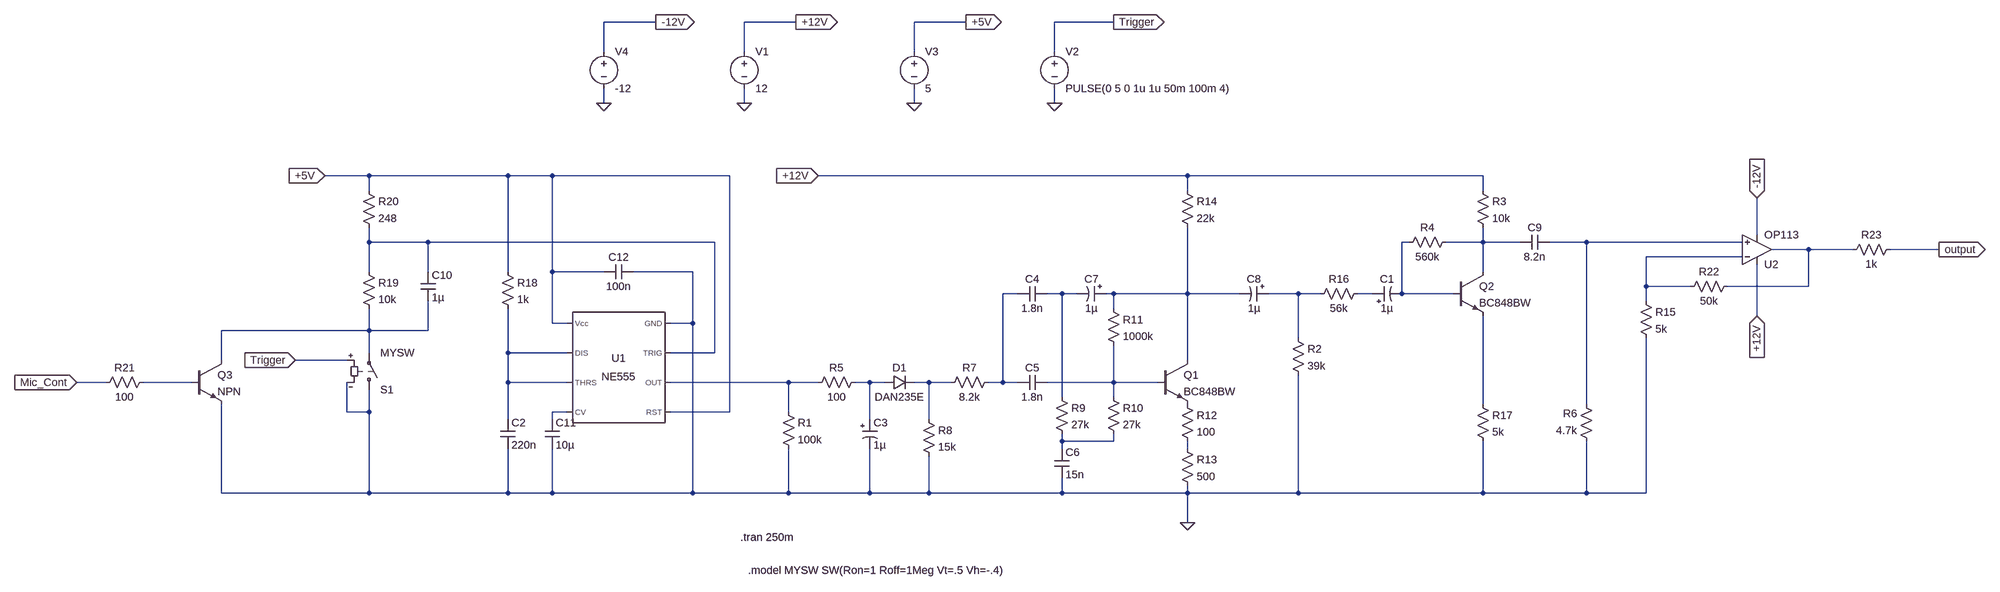
[diagram p0: schematic Platine_1.asc]
Platine_1.asc, the LTspice schematic file:
Version 4
SHEET 1 3512 680
WIRE 448 -880 336 -880
WIRE 752 -880 640 -880
WIRE 1120 -880 1008 -880
WIRE 1440 -880 1312 -880
WIRE 336 -816 336 -880
WIRE 640 -816 640 -880
WIRE 1008 -816 1008 -880
WIRE 1312 -816 1312 -880
WIRE 336 -704 336 -736
WIRE 640 -704 640 -736
WIRE 1008 -704 1008 -736
WIRE 1312 -704 1312 -736
WIRE -176 -480 -272 -480
WIRE 128 -480 -176 -480
WIRE 224 -480 128 -480
WIRE 608 -480 224 -480
WIRE 1600 -480 800 -480
WIRE 2240 -480 1600 -480
WIRE -176 -448 -176 -480
WIRE 1600 -448 1600 -480
WIRE 2240 -448 2240 -480
WIRE 2880 -352 2880 -432
WIRE -176 -336 -176 -368
WIRE -48 -336 -176 -336
WIRE 576 -336 -48 -336
WIRE 2080 -336 2064 -336
WIRE 2240 -336 2240 -368
WIRE 2240 -336 2160 -336
WIRE 2320 -336 2240 -336
WIRE 2464 -336 2384 -336
WIRE 2848 -336 2464 -336
WIRE 2992 -320 2912 -320
WIRE 3088 -320 2992 -320
WIRE 3376 -320 3168 -320
WIRE 2848 -304 2640 -304
WIRE -176 -272 -176 -336
WIRE -48 -272 -48 -336
WIRE 128 -272 128 -480
WIRE 224 -272 224 -480
WIRE 336 -272 224 -272
WIRE 528 -272 400 -272
WIRE 2240 -272 2240 -336
WIRE 2640 -240 2640 -304
WIRE 2736 -240 2640 -240
WIRE 2992 -240 2992 -320
WIRE 2992 -240 2816 -240
WIRE 1232 -224 1200 -224
WIRE 1328 -224 1296 -224
WIRE 1360 -224 1328 -224
WIRE 1440 -224 1424 -224
WIRE 1600 -224 1600 -368
WIRE 1600 -224 1440 -224
WIRE 1712 -224 1600 -224
WIRE 1840 -224 1776 -224
WIRE 1888 -224 1840 -224
WIRE 2000 -224 1968 -224
WIRE 2064 -224 2064 -336
WIRE 2176 -224 2064 -224
WIRE 2640 -208 2640 -240
WIRE 1440 -192 1440 -224
WIRE 2880 -176 2880 -288
WIRE 224 -160 224 -272
WIRE 256 -160 224 -160
WIRE 528 -160 528 -272
WIRE 528 -160 480 -160
WIRE -176 -144 -176 -192
WIRE -176 -144 -496 -144
WIRE -48 -144 -48 -208
WIRE -48 -144 -176 -144
WIRE 1840 -128 1840 -224
WIRE -176 -96 -176 -144
WIRE 128 -96 128 -192
WIRE 256 -96 128 -96
WIRE 576 -96 576 -336
WIRE 576 -96 480 -96
WIRE -496 -80 -496 -144
WIRE -224 -80 -336 -80
WIRE 1600 -80 1600 -224
WIRE -752 -32 -816 -32
WIRE -560 -32 -672 -32
WIRE 128 -32 128 -96
WIRE 256 -32 128 -32
WIRE 736 -32 480 -32
WIRE 800 -32 736 -32
WIRE 912 -32 880 -32
WIRE 944 -32 912 -32
WIRE 1040 -32 1008 -32
WIRE 1088 -32 1040 -32
WIRE 1200 -32 1200 -224
WIRE 1200 -32 1168 -32
WIRE 1232 -32 1200 -32
WIRE 1440 -32 1440 -112
WIRE 1440 -32 1296 -32
WIRE 1536 -32 1440 -32
WIRE 1328 0 1328 -224
WIRE 1440 0 1440 -32
WIRE 2240 16 2240 -176
WIRE 2464 16 2464 -336
WIRE -224 32 -224 -32
WIRE -176 32 -176 -16
WIRE -176 32 -224 32
WIRE 256 32 224 32
WIRE 608 32 608 -480
WIRE 608 32 480 32
WIRE 736 32 736 -32
WIRE 128 48 128 -32
WIRE 224 48 224 32
WIRE 912 48 912 -32
WIRE 1040 48 1040 -32
WIRE 1328 96 1328 80
WIRE 1440 96 1440 80
WIRE 1440 96 1328 96
WIRE 1328 112 1328 96
WIRE 1600 112 1600 96
WIRE -496 208 -496 16
WIRE -176 208 -176 32
WIRE -176 208 -496 208
WIRE 128 208 128 112
WIRE 128 208 -176 208
WIRE 224 208 224 112
WIRE 224 208 128 208
WIRE 528 208 528 -160
WIRE 528 208 224 208
WIRE 736 208 736 112
WIRE 736 208 528 208
WIRE 912 208 912 112
WIRE 912 208 736 208
WIRE 1040 208 1040 128
WIRE 1040 208 912 208
WIRE 1328 208 1328 176
WIRE 1328 208 1040 208
WIRE 1600 208 1600 192
WIRE 1600 208 1328 208
WIRE 1840 208 1840 -48
WIRE 1840 208 1600 208
WIRE 2240 208 2240 96
WIRE 2240 208 1840 208
WIRE 2464 208 2464 96
WIRE 2464 208 2240 208
WIRE 2640 208 2640 -128
WIRE 2640 208 2464 208
WIRE 1600 272 1600 208
FLAG 752 -880 +12V
IOPIN 752 -880 Out
FLAG 640 -704 0
FLAG 1440 -880 Trigger
IOPIN 1440 -880 Out
FLAG 1312 -704 0
FLAG 1600 272 0
FLAG 800 -480 +12V
IOPIN 800 -480 In
FLAG -336 -80 Trigger
IOPIN -336 -80 In
FLAG 1120 -880 +5V
IOPIN 1120 -880 Out
FLAG 1008 -704 0
FLAG -272 -480 +5V
IOPIN -272 -480 In
FLAG -816 -32 Mic_Cont
IOPIN -816 -32 In
FLAG 3376 -320 output
IOPIN 3376 -320 Out
FLAG 448 -880 -12V
IOPIN 448 -880 Out
FLAG 336 -704 0
FLAG 2880 -432 -12V
IOPIN 2880 -432 In
FLAG 2880 -176 +12V
IOPIN 2880 -176 In
SYMBOL res 1184 -48 R90
WINDOW 0 0 56 VBottom 2
WINDOW 3 32 56 VTop 2
SYMATTR InstName R7
SYMATTR Value 8.2k
SYMBOL cap 1296 -48 R90
WINDOW 0 0 32 VBottom 2
WINDOW 3 32 32 VTop 2
SYMATTR InstName C5
SYMATTR Value 1.8n
SYMBOL res 1024 32 R0
SYMATTR InstName R8
SYMATTR Value 15k
SYMBOL res 1312 -16 R0
SYMATTR InstName R9
SYMATTR Value 27k
SYMBOL cap 1312 112 R0
SYMATTR InstName C6
SYMATTR Value 15n
SYMBOL res 1424 -16 R0
SYMATTR InstName R10
SYMATTR Value 27k
SYMBOL res 1424 -208 R0
SYMATTR InstName R11
SYMATTR Value 1000k
SYMBOL res 1584 0 R0
SYMATTR InstName R12
SYMATTR Value 100
SYMBOL res 1584 96 R0
SYMATTR InstName R13
SYMATTR Value 500
SYMBOL voltage 640 -832 R0
WINDOW 123 0 0 Left 0
WINDOW 39 0 0 Left 0
SYMATTR InstName V1
SYMATTR Value 12
SYMBOL res 896 -48 R90
WINDOW 0 0 56 VBottom 2
WINDOW 3 32 56 VTop 2
SYMATTR InstName R5
SYMATTR Value 100
SYMBOL polcap 896 48 R0
SYMATTR InstName C3
SYMATTR Value 1µ
SYMATTR SpiceLine V=10
SYMBOL diode 944 -16 R270
WINDOW 0 32 32 VTop 2
WINDOW 3 0 32 VBottom 2
SYMATTR InstName D1
SYMATTR Value DAN235E
SYMBOL cap 1296 -240 R90
WINDOW 0 0 32 VBottom 2
WINDOW 3 32 32 VTop 2
SYMATTR InstName C4
SYMATTR Value 1.8n
SYMBOL polcap 1424 -240 R90
WINDOW 0 0 32 VBottom 2
WINDOW 3 32 32 VTop 2
SYMATTR InstName C7
SYMATTR Value 1µ
SYMATTR SpiceLine V=25
SYMBOL polcap 1776 -240 R90
WINDOW 0 0 32 VBottom 2
WINDOW 3 32 32 VTop 2
SYMATTR InstName C8
SYMATTR Value 1µ
SYMATTR SpiceLine V=25
SYMBOL npn 1536 -80 R0
SYMATTR InstName Q1
SYMATTR Value BC848BW
SYMBOL res 1584 -464 R0
SYMATTR InstName R14
SYMATTR Value 22k
SYMBOL voltage 1312 -832 R0
WINDOW 123 0 0 Left 0
WINDOW 39 0 0 Left 0
SYMATTR InstName V2
SYMATTR Value PULSE(0 5 0 1u 1u 50m 100m 4)
SYMBOL res 720 16 R0
SYMATTR InstName R1
SYMATTR Value 100k
SYMBOL res 1824 -144 R0
SYMATTR InstName R2
SYMATTR Value 39k
SYMBOL polcap 2000 -208 R270
WINDOW 0 32 32 VTop 2
WINDOW 3 0 32 VBottom 2
SYMATTR InstName C1
SYMATTR Value 1µ
SYMATTR SpiceLine V=25
SYMBOL npn 2176 -272 R0
SYMATTR InstName Q2
SYMATTR Value BC848BW
SYMBOL res 2224 -464 R0
SYMATTR InstName R3
SYMATTR Value 10k
SYMBOL res 2176 -352 R90
WINDOW 0 0 56 VBottom 2
WINDOW 3 32 56 VTop 2
SYMATTR InstName R4
SYMATTR Value 560k
SYMBOL res 2480 112 R180
WINDOW 0 36 76 Left 2
WINDOW 3 36 40 Left 2
SYMATTR InstName R6
SYMATTR Value 4.7k
SYMBOL res 1984 -240 R90
WINDOW 0 0 56 VBottom 2
WINDOW 3 32 56 VTop 2
SYMATTR InstName R16
SYMATTR Value 56k
SYMBOL res 2224 0 R0
SYMATTR InstName R17
SYMATTR Value 5k
SYMBOL cap 2384 -352 R90
WINDOW 0 0 32 VBottom 2
WINDOW 3 32 32 VTop 2
SYMATTR InstName C9
SYMATTR Value 8.2n
SYMBOL Misc\\NE555 368 -64 M0
SYMATTR InstName U1
SYMBOL voltage 1008 -832 R0
WINDOW 123 0 0 Left 0
WINDOW 39 0 0 Left 0
SYMATTR InstName V3
SYMATTR Value 5
SYMBOL res 112 -288 R0
SYMATTR InstName R18
SYMATTR Value 1k
SYMBOL cap 112 48 R0
SYMATTR InstName C2
SYMATTR Value 220n
SYMBOL cap -64 -272 R0
SYMATTR InstName C10
SYMATTR Value 1µ
SYMBOL res -192 -288 R0
SYMATTR InstName R19
SYMATTR Value 10k
SYMBOL res -192 -464 R0
SYMATTR InstName R20
SYMATTR Value 248
SYMBOL npn -560 -80 R0
SYMATTR InstName Q3
SYMBOL sw -176 0 M180
SYMATTR InstName S1
SYMATTR Value MYSW
SYMBOL res -656 -48 R90
WINDOW 0 0 56 VBottom 2
WINDOW 3 32 56 VTop 2
SYMATTR InstName R21
SYMATTR Value 100
SYMBOL cap 208 48 R0
SYMATTR InstName C11
SYMATTR Value 10µ
SYMBOL cap 400 -288 R90
WINDOW 0 0 32 VBottom 2
WINDOW 3 32 32 VTop 2
SYMATTR InstName C12
SYMATTR Value 100n
SYMBOL OpAmps\\OP113 2880 -256 M180
SYMATTR InstName U2
SYMBOL voltage 336 -832 R0
WINDOW 123 0 0 Left 0
WINDOW 39 0 0 Left 0
SYMATTR InstName V4
SYMATTR Value -12
SYMBOL res 2624 -224 R0
SYMATTR InstName R15
SYMATTR Value 5k
SYMBOL res 2832 -256 R90
WINDOW 0 0 56 VBottom 2
WINDOW 3 32 56 VTop 2
SYMATTR InstName R22
SYMATTR Value 50k
SYMBOL res 3184 -336 R90
WINDOW 0 0 56 VBottom 2
WINDOW 3 32 56 VTop 2
SYMATTR InstName R23
SYMATTR Value 1k
TEXT 632 304 Left 2 !.tran 250m
TEXT 648 376 Left 2 !.model MYSW SW(Ron=1 Roff=1Meg Vt=.5 Vh=-.4)

The netlist it stands for:
* Platine_1.asc
R7 N007 N017 8.2k
C5 N018 N007 1.8n
R8 N017 0 15k
R9 N008 N021 27k
C6 N021 0 15n
R10 N018 N021 27k
R11 N009 N018 1000k
R12 P001 N022 100
R13 N022 0 500
V1 +12V 0 12
R5 N016 N015 100
C3 N016 0 1µ V=10
D1 N016 N017 DAN235E
C4 N008 N007 1.8n
C7 N009 N008 1µ V=25
C8 N010 N009 1µ V=25
Q1 N009 N018 P001 0 BC848BW
R14 +12V N009 22k
V2 Trigger 0 PULSE(0 5 0 1u 1u 50m 100m 4)
R1 N015 0 100k
R2 N010 0 39k
C1 N011 N002 1µ V=25
Q2 N003 N002 N019 0 BC848BW
R3 +12V N003 10k
R4 N003 N002 560k
R6 0 N004 4.7k
R16 N011 N010 56k
R17 N019 0 5k
C9 N004 N003 8.2n
XU1 0 N001 N015 +5V N020 N013 N013 +5V NE555  ; pins GND TRIG OUT RST CV THRS DIS Vcc
V3 +5V 0 5
R18 +5V N013 1k
C2 N013 0 220n
C10 N001 N012 1µ
R19 N001 N012 10k
R20 +5V N001 248
Q3 N012 N014 0 0 NPN
S1 0 N012 Trigger 0 MYSW
R21 N014 Mic_Cont 100
C11 N020 0 10µ
C12 0 +5V 100n
XU2 N004 N006 +12V -12V N005 OP113  ; pins In+ In- V+ V- OUT
V4 -12V 0 -12
R15 N006 0 5k
R22 N005 N006 50k
R23 output N005 1k
.model D D
.lib standard.dio
.model NPN NPN
.model PNP PNP
.lib standard.bjt
.tran 250m
.model MYSW SW(Ron=1 Roff=1Meg Vt=.5 Vh=-.4)
.lib NE555.sub
.lib ADI.lib
.backanno
.end

* Results of the author's LTspice run, read from the files saved beside the schematic
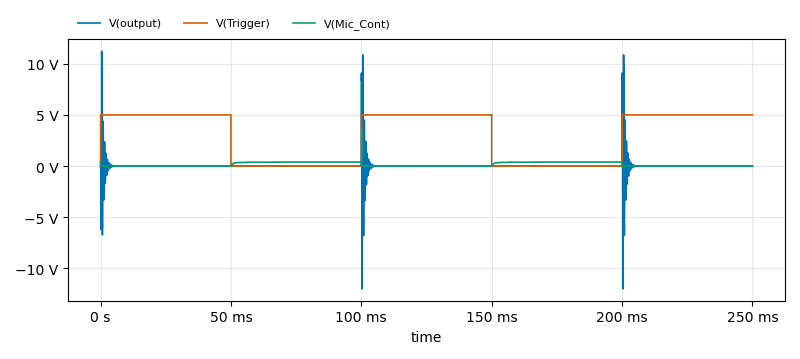
[diagram p1: Transient Analysis of Platine_1.asc, plotted from the saved traces]
* Transient Analysis, 1 run:
*   V(output): min -12 V, max 11.22 V, average 3.005 mV, rms 626.2 mV, last 2.626 mV
*   V(Trigger): min 0 V, max 5 V, average 3 V, rms 3.873 V, last 5 V
*   V(Mic_Cont): min 244.4 µV, max 394.2 mV, average 152.5 mV, rms 241.9 mV, last 244.4 µV